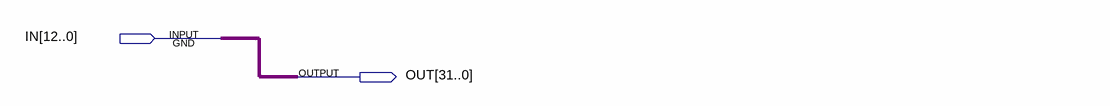
[diagram p0: schematic sheet]
// Quartus schematic signext13_32.bdf as structural Verilog: 0 symbols, 2 pins
module signext13_32 (
  input  [12:0] IN,
  output [31:0] OUT
);


  assign OUT = {{20{IN[12]}}, IN[11:0]};
endmodule
